# EAGLE design MMProtoShield (EAGLE 7.7.0)
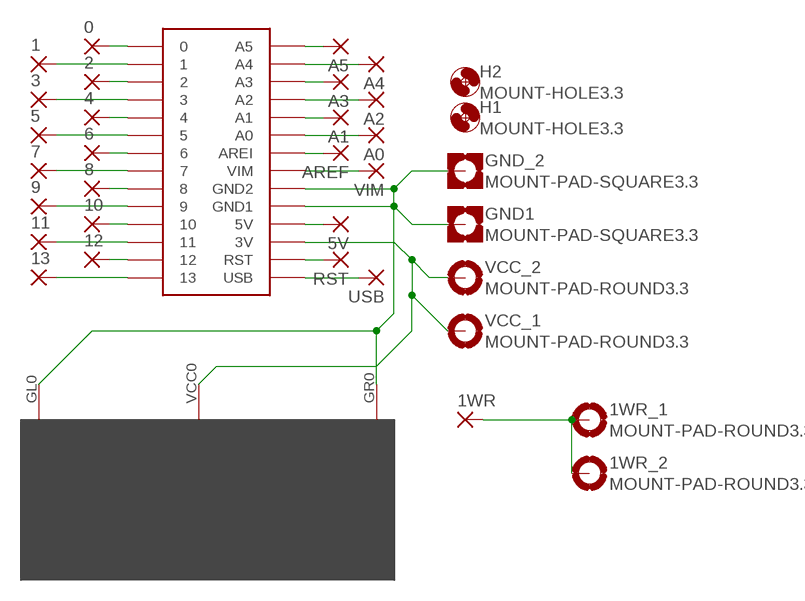
[diagram p0: schematic, sheet 1]

## Parts
0  1,6/0,9  [1,6/0,9]
1  1,6/0,9  [1,6/0,9]
1WR  1,6/0,9  [1,6/0,9]
1WR_1  MOUNT-PAD-ROUND3.3  [3,3-PAD]
1WR_2  MOUNT-PAD-ROUND3.3  [3,3-PAD]
2  1,6/0,9  [1,6/0,9]
3  1,6/0,9  [1,6/0,9]
4  1,6/0,9  [1,6/0,9]
5  1,6/0,9  [1,6/0,9]
5V  1,6/0,9  [1,6/0,9]
6  1,6/0,9  [1,6/0,9]
7  1,6/0,9  [1,6/0,9]
8  1,6/0,9  [1,6/0,9]
9  1,6/0,9  [1,6/0,9]
10  1,6/0,9  [1,6/0,9]
11  1,6/0,9  [1,6/0,9]
12  1,6/0,9  [1,6/0,9]
13  1,6/0,9  [1,6/0,9]
A0  1,6/0,9  [1,6/0,9]
A1  1,6/0,9  [1,6/0,9]
A2  1,6/0,9  [1,6/0,9]
A3  1,6/0,9  [1,6/0,9]
A4  1,6/0,9  [1,6/0,9]
A5  1,6/0,9  [1,6/0,9]
AREF  1,6/0,9  [1,6/0,9]
GND1  MOUNT-PAD-SQUARE3.3  [3,3-PAD-SQUARE]
GND_2  MOUNT-PAD-SQUARE3.3  [3,3-PAD-SQUARE]
H1  MOUNT-HOLE3.3  [3,3]
H2  MOUNT-HOLE3.3  [3,3]
RST  1,6/0,9  [1,6/0,9]
U$1  METRO_MINI_FOOTPRINT  [METRO_MINI_FOOTPRINT]
U$2  PROTOAREA  [PROTOAREA]
USB  1,6/0,9  [1,6/0,9]
VCC_1  MOUNT-PAD-ROUND3.3  [3,3-PAD]
VCC_2  MOUNT-PAD-ROUND3.3  [3,3-PAD]
VIM  1,6/0,9  [1,6/0,9]

## Nets
N$1: A5.1(P) U$1.A5
N$2: A4.1(P) U$1.A4
N$3: A3.1(P) U$1.A3
N$4: 0.1(P) U$1.0
N$5: 1.1(P) U$1.1
N$6: 2.1(P) U$1.2
N$7: 3.1(P) U$1.3
N$8: 4.1(P) U$1.4
N$9: 5.1(P) U$1.5
N$10: 6.1(P) U$1.6
N$11: 7.1(P) U$1.7
N$12: 8.1(P) U$1.8
N$13: 9.1(P) U$1.9
N$14: 10.1(P) U$1.10
N$15: 11.1(P) U$1.11
N$16: 12.1(P) U$1.12
N$17: 13.1(P) U$1.13
N$18: A2.1(P) U$1.A2
N$19: 1WR.1(P) 1WR_1.B3,3(MOUNT) 1WR_2.B3,3(MOUNT)
N$20: A1.1(P) U$1.A1
N$21: A0.1(P) U$1.A0
N$22: AREF.1(P) U$1.AREF(AREI)
N$23: U$1.VIN(VIM) VIM.1(P)
N$24: 5V.1(P) U$1.5V
N$25: RST.1(P) U$1.RST
N$26: U$1.USB USB.1(P)
N$28: GND1.B3,3(MOUNT) GND_2.B3,3(MOUNT) U$1.GND1 U$1.GND2 U$2.GL0(RAIL1) U$2.GR0(RAIL3)
N$29: U$1.3V U$2.VCC0(RAIL2) VCC_1.B3,3(MOUNT) VCC_2.B3,3(MOUNT)

## Library data of the parts
0 1 1WR 2-5 5V 6-13 A0 A1-A5 AREF RST USB VIM = wirepad:1,6/0,9: THROUGH-HOLE PAD
1WR_1 1WR_2 VCC_1 VCC_2 = holes:MOUNT-PAD-ROUND: MOUNTING PAD, round
GND1 GND_2 = holes:MOUNT-PAD-SQUARE: MOUNTING PAD, square
H1 H2 = holes:MOUNT-HOLE: MOUNTING HOLE with drill center marker
U$1 = MetroMiniProtoshield:METRO_MINI_FOOTPRINT
U$2 = MetroMiniProtoshield:PROTOAREA

## Board
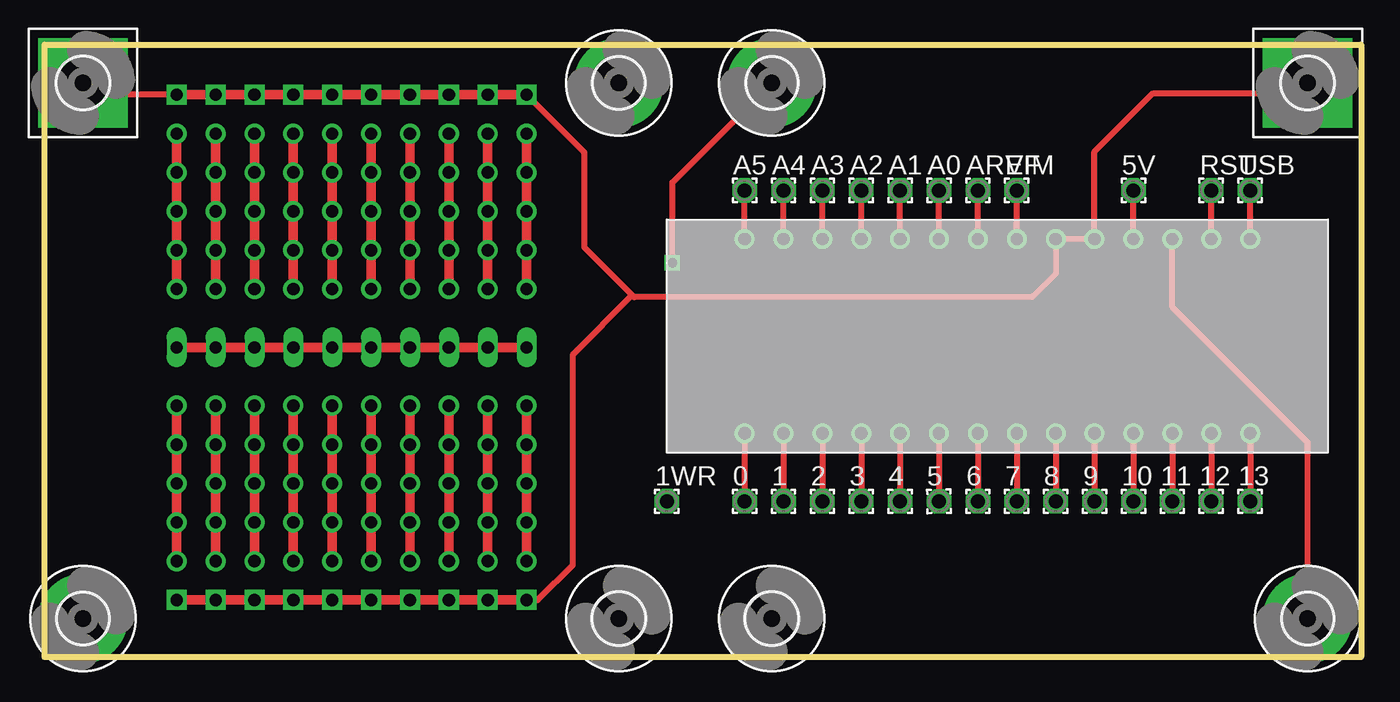
[diagram p1: board, top side]
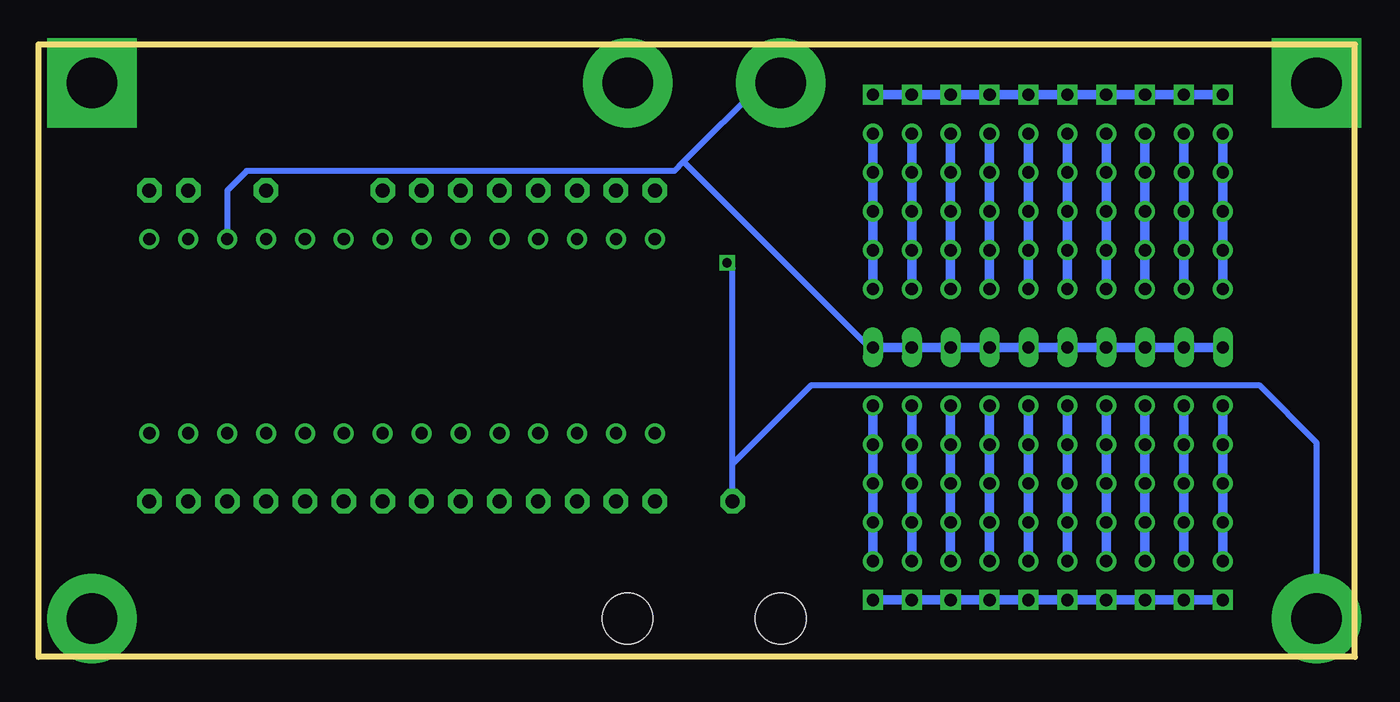
[diagram p2: board, bottom side, seen from below]

Size 86 x 40 mm. Coordinates in mm from the lower left corner, seen from the top.
Outline: 0,0 0,40 86,40 86,0 0,0
Copper layers (1*16): Top 0.035mm / dielectric 1.5mm / Bottom 0.035mm
Design rules "default": minimum track width 10mil, minimum drill 24mil, track to track 8mil, track to pad 8mil, pad to pad 8mil, via to via 8mil, smd to smd 8mil, copper to edge 40mil, drill to drill 8mil, minimum pad ring 10mil, minimum via ring 8mil, stop-mask expansion 4mil, vias tented up to drill 0mil, thermal gap 10mil

### Footprints (pad centres in the part's own frame; a part is rotated, then mirrored left to right if it is on the bottom)
1,6/0,9 = drill 0.914 pad 1.6 octagon: 1 0,0
3,3-PAD = drill 3.3 pad 5.842: B3,3 0,0
3,3-PAD-SQUARE = drill 3.3 pad 5.842 square: B3,3 0,0
3,3 = hole 3.3: 0,0
METRO_MINI_FOOTPRINT = drill 0.8: 0 0,0; 1 0,-2.54; 2 0,-5.08; 3 0,-7.62; 3V 12.7,-27.94; 4 0,-10.16; 5 0,-12.7; 5V 12.7,-25.4; 6 0,-15.24; 7 0,-17.78; 8 0,-20.32; 9 0,-22.86; 10 0,-25.4; 11 0,-27.94; 12 0,-30.48; 13 0,-33.02; A0 12.7,-12.7; A1 12.7,-10.16; A2 12.7,-7.62; A3 12.7,-5.08; A4 12.7,-2.54; A5 12.7,0; AREF 12.7,-15.24; GND1 12.7,-22.86; GND2 12.7,-20.32; RST 12.7,-30.48; USB 12.7,-33.02; VIN 12.7,-17.78
PROTOAREA = drill 0.8: A0 -1.27,-3.81; A1 -3.81,-3.81; A2 -6.35,-3.81; A3 -8.89,-3.81; A4 -11.43,-3.81; A5 -13.97,-3.81; A6 -16.51,-3.81; A7 -19.05,-3.81; A8 -21.59,-3.81; A9 -24.13,-3.81; B0 -1.27,-6.35; B1 -3.81,-6.35; B2 -6.35,-6.35; B3 -8.89,-6.35; B4 -11.43,-6.35; B5 -13.97,-6.35; B6 -16.51,-6.35; B7 -19.05,-6.35; B8 -21.59,-6.35; B9 -24.13,-6.35; C0 -1.27,-8.89; C1 -3.81,-8.89; C2 -6.35,-8.89; C3 -8.89,-8.89; C4 -11.43,-8.89; C5 -13.97,-8.89; C6 -16.51,-8.89; C7 -19.05,-8.89; C8 -21.59,-8.89; C9 -24.13,-8.89; D1 -3.81,-11.43; D2 -6.35,-11.43; D3 -8.89,-11.43; D4 -11.43,-11.43; D5 -13.97,-11.43; D6 -16.51,-11.43; D7 -19.05,-11.43; D8 -21.59,-11.43; D9 -24.13,-11.43; DO -1.27,-11.43; E1 -3.81,-13.97; E2 -6.35,-13.97; E3 -8.89,-13.97; E4 -11.43,-13.97; E5 -13.97,-13.97; E6 -16.51,-13.97; E7 -19.05,-13.97; E8 -21.59,-13.97; E9 -24.13,-13.97; EO -1.27,-13.97; F0 -1.27,-21.59; F1 -3.81,-21.59; F2 -6.35,-21.59; F3 -8.89,-21.59; F4 -11.43,-21.59; F5 -13.97,-21.59; F6 -16.51,-21.59; F7 -19.05,-21.59; F8 -21.59,-21.59; F9 -24.13,-21.59; G0 -1.27,-24.13; G1 -3.81,-24.13; G2 -6.35,-24.13; G3 -8.89,-24.13; G4 -11.43,-24.13; G5 -13.97,-24.13; G6 -16.51,-24.13; G7 -19.05,-24.13; G8 -21.59,-24.13; G9 -24.13,-24.13; H0 -1.27,-26.67; H1 -3.81,-26.67; H2 -6.35,-26.67; H3 -8.89,-26.67; H4 -11.43,-26.67; H5 -13.97,-26.67; H6 -16.51,-26.67; H7 -19.05,-26.67; H8 -21.59,-26.67; H9 -24.13,-26.67; I0 -1.27,-29.21; I1 -3.81,-29.21; I2 -6.35,-29.21; I3 -8.89,-29.21; I4 -11.43,-29.21; I5 -13.97,-29.21; I6 -16.51,-29.21; I7 -19.05,-29.21; I8 -21.59,-29.21; I9 -24.13,-29.21; J0 -1.27,-31.75; J1 -3.81,-31.75; J2 -6.35,-31.75; J3 -8.89,-31.75; J4 -11.43,-31.75; J5 -13.97,-31.75; J6 -16.51,-31.75; J7 -19.05,-31.75; J8 -21.59,-31.75; J9 -24.13,-31.75 | drill 0.8 square: GL0 -1.27,-1.27; GL1 -3.81,-1.27; GL2 -6.35,-1.27; GL3 -8.89,-1.27; GL4 -11.43,-1.27; GL5 -13.97,-1.27; GL6 -16.51,-1.27; GL7 -19.05,-1.27; GL8 -21.59,-1.27; GL9 -24.13,-1.27; GR0 -1.27,-34.29; GR1 -3.81,-34.29; GR2 -6.35,-34.29; GR3 -8.89,-34.29; GR4 -11.43,-34.29; GR5 -13.97,-34.29; GR6 -16.51,-34.29; GR7 -19.05,-34.29; GR8 -21.59,-34.29; GR9 -24.13,-34.29 | drill 0.8 long: VCC0 -1.27,-17.78; VCC1 -3.81,-17.78; VCC2 -6.35,-17.78; VCC3 -8.89,-17.78; VCC4 -11.43,-17.78; VCC5 -13.97,-17.78; VCC6 -16.51,-17.78; VCC7 -19.05,-17.78; VCC8 -21.59,-17.78; VCC9 -24.13,-17.78

### Placement (x,y rotation side)
0  45.72,10.16 0 top
1  48.26,10.16 0 top
1WR  40.64,10.16 0 top
1WR_1  47.5,37.5 0 top
1WR_2  2.5,2.5 0 top
2  50.8,10.16 0 top
3  53.34,10.16 0 top
4  55.88,10.16 0 top
5  58.42,10.16 1 top
5V  71.12,30.48 0 top
6  60.96,10.16 0 top
7  63.5,10.16 0 top
8  66.04,10.16 0 top
9  68.58,10.16 0 top
10  71.12,10.16 0 top
11  73.66,10.16 0 top
12  76.2,10.16 0 top
13  78.74,10.16 0 top
A0  58.42,30.48 0 top
A1  55.88,30.48 0 top
A2  53.34,30.48 0 top
A3  50.8,30.48 0 top
A4  48.26,30.48 0 top
A5  45.72,30.48 0 top
AREF  60.96,30.48 0 top
GND1  82.5,37.5 0 top
GND_2  2.5,37.5 0 top
H1  47.5,2.5 0 top
H2  37.5,2.5 0 top
RST  76.2,30.48 0 top
U$1  45.72,14.61 90 top
U$2  32.75,38 0 top
USB  78.74,30.48 0 top
VCC_1  82.5,2.5 0 top
VCC_2  37.5,37.5 0 top
VIM  63.5,30.48 0 top

### Tracks (layer width: path | path; a pad name or v marks a point on that pad's centre or on a via)
N$1
  Top 0.406: U$1.A5 A5.1
N$2
  Top 0.406: U$1.A4 A4.1
N$3
  Top 0.406: U$1.A3 A3.1
N$4
  Top 0.406: U$1.0 0.1
N$5
  Top 0.406: U$1.1 1.1
N$6
  Top 0.406: U$1.2 2.1
N$7
  Top 0.406: U$1.3 3.1
N$8
  Top 0.406: U$1.4 4.1
N$9
  Top 0.406: U$1.5 5.1
N$10
  Top 0.406: U$1.6 6.1
N$11
  Top 0.406: U$1.7 7.1
N$12
  Top 0.406: U$1.8 8.1
N$13
  Top 0.406: U$1.9 9.1
N$14
  Top 0.406: U$1.10 10.1
N$15
  Top 0.406: U$1.11 11.1
N$16
  Top 0.406: U$1.12 12.1
N$17
  Top 0.406: U$1.13 13.1
N$18
  Top 0.406: U$1.A2 A2.1
N$19  (via drill 0.6)
  Top 0.406: v41,25.75 41,31 1WR_1.B3,3
  Bottom 0.406: 1WR_2.B3,3 2.5,14 6.25,17.75 35.5,17.75 40.64,12.61 1WR.1 40.64,25.39 v41,25.75
N$20
  Top 0.406: U$1.A1 A1.1
N$21
  Top 0.406: U$1.A0 A0.1
N$22
  Top 0.406: U$1.AREF AREF.1
N$23
  Top 0.406: U$1.VIN VIM.1
N$24
  Top 0.406: U$1.5V 5V.1
N$25
  Top 0.406: U$1.RST RST.1
N$26
  Top 0.406: U$1.USB USB.1
N$28
  Top 0.406: GND1.B3,3 81.83,36.83 72.39,36.83 68.58,33.02 U$1.GND1 U$1.GND2 66.04,25.04 64.5,23.5 38.5,23.5 38.38,23.62 | 38.38,23.62 35.25,26.75 35.25,32.96 U$2.GL0 | 8.62,36.73 3.27,36.73 GND_2.B3,3 | U$2.GR0 32.21,3.71 34.5,6 34.5,19.75 38.38,23.62
N$29
  Top 0.406: VCC_1.B3,3 82.5,14.02 73.66,22.86 U$1.3V
  Bottom 0.406: VCC_2.B3,3 38.7,37.5 43.85,32.35 | 43.85,32.35 44.45,31.75 72.39,31.75 73.66,30.48 U$1.3V | U$2.VCC0 31.72,20.22 43.85,32.35